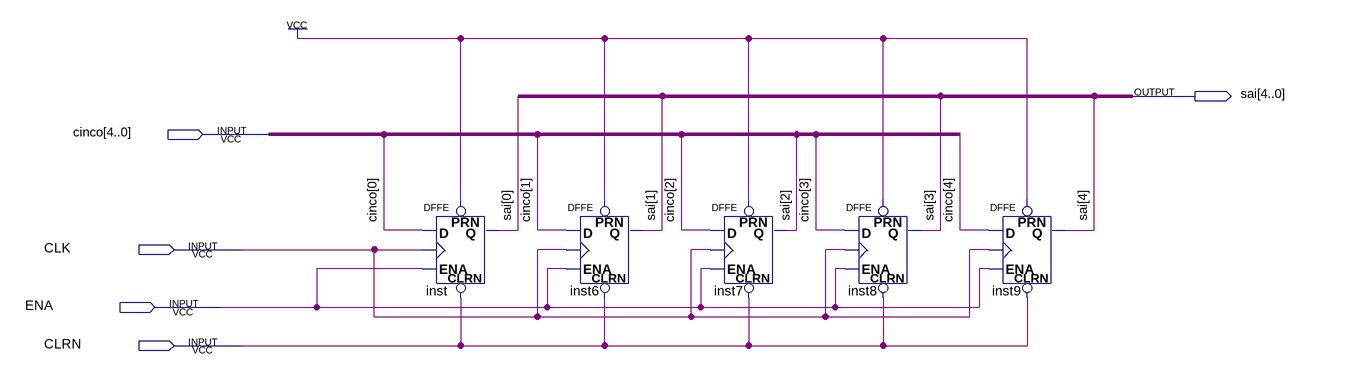
[diagram p0: schematic sheet]
// Quartus schematic REGISTRADOR5bits.bdf as structural Verilog: 5 symbols, 5 pins
module REGISTRADOR5bits (
  input  [4:0] cinco,
  input  CLK,
  input  ENA,
  input  CLRN,
  output [4:0] sai
);

  DFFE inst (.PRN(1'b1), .CLRN(CLRN), .D(cinco[0]), .CLK(CLK), .ENA(ENA), .Q(sai[0]));
  DFFE inst6 (.PRN(1'b1), .CLRN(CLRN), .D(cinco[1]), .CLK(CLK), .ENA(ENA), .Q(sai[1]));
  DFFE inst7 (.PRN(1'b1), .CLRN(CLRN), .D(cinco[2]), .CLK(CLK), .ENA(ENA), .Q(sai[2]));
  DFFE inst8 (.PRN(1'b1), .CLRN(CLRN), .D(cinco[3]), .CLK(CLK), .ENA(ENA), .Q(sai[3]));
  DFFE inst9 (.PRN(1'b1), .CLRN(CLRN), .D(cinco[4]), .CLK(CLK), .ENA(ENA), .Q(sai[4]));
endmodule
